# EAGLE design OYE328p (EAGLE 9.2.2)
The open Yag-E controller was designed to work with GRBL firmware https://github.com/gnea/grbl for use with the Open Yag-E project https://www.thingiverse.com/thing:3170231 This board is intended to use pololu a4988 or compatible drivers https://www.pololu.com/category/156/a4988-stepper-motor-driver-carriers Open Yag-E 328p Controller board by Jeff Thompson is licensed under a Creative Commons Attribution-ShareAlike 4.0 International License.
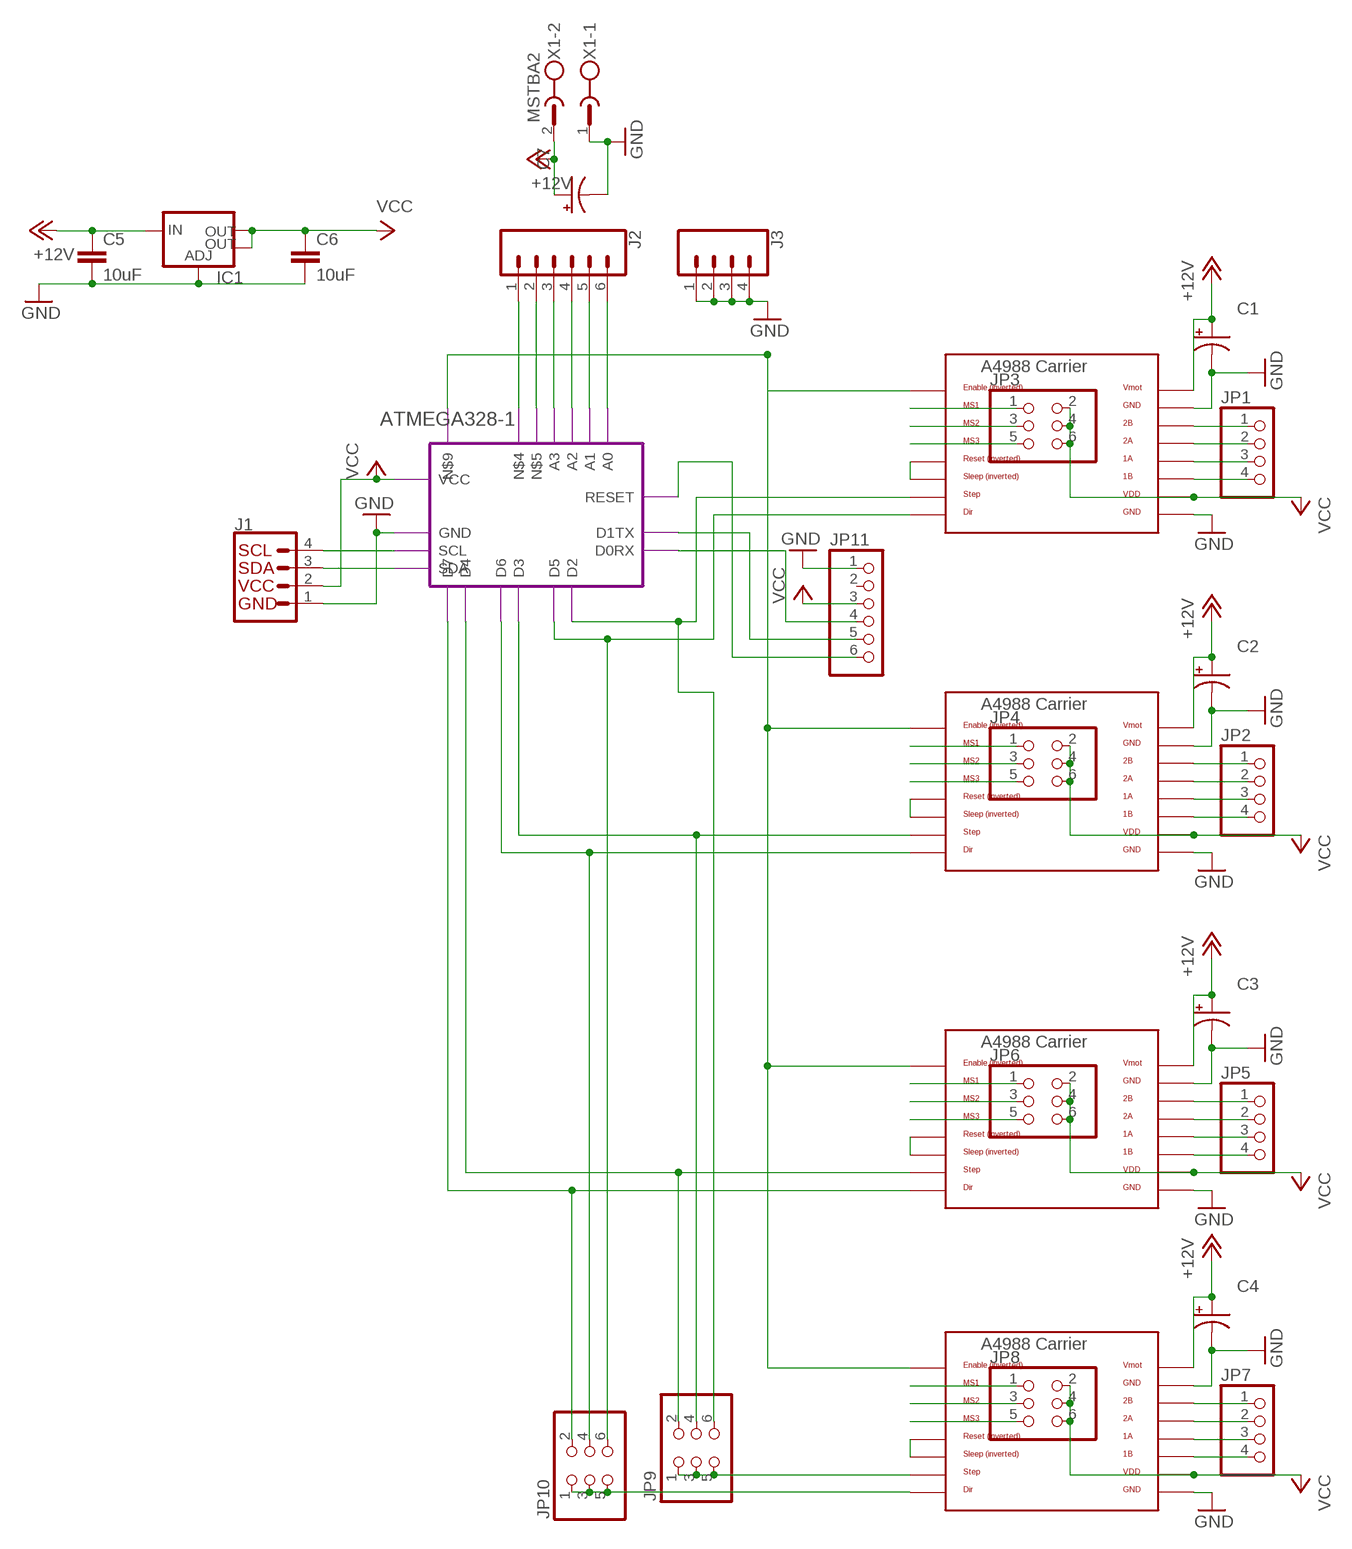
[diagram p0: schematic, sheet 1]

## Parts
C1  CPOL-USD  [PANASONIC_D]
C2  CPOL-USD  [PANASONIC_D]
C3  CPOL-USD  [PANASONIC_D]
C4  CPOL-USD  [PANASONIC_D]
C5  10uF  10UF-0805-10V-10%  [0805]
C6  10uF  10UF-0805-10V-10%  [0805]
C7  CPOL-USD  [PANASONIC_D]
IC1  V_REG_LM1117SOT223  [SOT223]
J1  I2C_STANDARD  [1X04]
J2  CONN_063.5MM-6  [SCREWTERMINAL-3.5MM-6]
J3  CONN_04SCREW  [SCREWTERMINAL-3.5MM-4]
JP1  PINHD-1X4  [1X04]
JP2  PINHD-1X4  [1X04]
JP3  PINHD-2X3  [2X03]
JP4  PINHD-2X3  [2X03]
JP5  PINHD-1X4  [1X04]
JP6  PINHD-2X3  [2X03]
JP7  PINHD-1X4  [1X04]
JP8  PINHD-2X3  [2X03]
JP9  PINHD-2X3  [2X03]
JP10  PINHD-2X3  [2X03]
JP11  PINHD-1X6  [1X06]
U$1  A4988BREAKOUT  [A4988BREAKOUT]
U$2  A4988BREAKOUT  [A4988BREAKOUT]
U$3  A4988BREAKOUT  [A4988BREAKOUT]
U$4  A4988BREAKOUT  [A4988BREAKOUT]
X1  MSTBA2  [MSTBA2]

## Module instances
ATMEGA328-1 = ATMEGA328

## Nets
+12V [power]: C1.+ C2.+ C3.+ C4.+ C5.1 C7.+ IC1.3(IN) U$1.VMOT U$2.VMOT U$3.VMOT U$4.VMOT X1.2
GND [12v]: C1.- C2.- C3.- C4.- C5.2 C6.2 C7.- IC1.1(ADJ) J1.1 J3.1 J3.2 J3.3 J3.4 JP11.1 U$1.GND U$1.GND@0(GND) U$2.GND U$2.GND@0(GND) U$3.GND U$3.GND@0(GND) U$4.GND U$4.GND@0(GND) X1.1 ; port ATMEGA328-1.GND
N$1 [sig]: JP4.1 U$2.MS1
N$2: JP4.3 U$2.MS2
N$3: JP4.5 U$2.MS3
N$4 [12v]: JP2.1 U$2.2B
N$5 [12v]: JP2.2 U$2.2A
N$6 [12v]: JP2.3 U$2.1A
N$7 [12v]: JP2.4 U$2.1B
N$8 [sig]: JP3.1 U$1.MS1
N$9: JP3.3 U$1.MS2
N$10: JP3.5 U$1.MS3
N$11: U$2.RST U$2.SLP(SLEEP)
N$12 [sig]: JP6.1 U$3.MS1
N$13 [12v]: JP1.1 U$1.2B
N$14 [12v]: JP1.2 U$1.2A
N$15 [12v]: JP1.3 U$1.1A
N$16 [12v]: JP1.4 U$1.1B
N$17: JP6.3 U$3.MS2
N$18: JP6.5 U$3.MS3
N$19 [12v]: JP5.1 U$3.2B
N$20 [12v]: JP5.2 U$3.2A
N$21 [12v]: JP5.3 U$3.1A
N$22 [12v]: JP5.4 U$3.1B
N$23: U$3.RST U$3.SLP(SLEEP)
N$24 [sig]: JP8.1 U$4.MS1
N$25: JP8.3 U$4.MS2
N$26: JP8.5 U$4.MS3
N$27 [12v]: JP7.1 U$4.2B
N$28 [12v]: JP7.2 U$4.2A
N$29 [12v]: JP7.3 U$4.1A
N$30 [12v]: JP7.4 U$4.1B
N$31: U$4.RST U$4.SLP(SLEEP)
N$32: U$1.EN U$2.EN U$3.EN U$4.EN ; port ATMEGA328-1.N$9
N$33: JP9.6 U$1.STEP ; port ATMEGA328-1.D2
N$34: JP10.6 U$1.DIR ; port ATMEGA328-1.D5
N$35: JP9.4 U$2.STEP ; port ATMEGA328-1.D3
N$36: JP10.4 U$2.DIR ; port ATMEGA328-1.D6
N$37: JP9.2 U$3.STEP ; port ATMEGA328-1.D4
N$38: JP10.2 U$3.DIR ; port ATMEGA328-1.D7
N$39: JP9.1 JP9.3 JP9.5 U$4.STEP
N$40: JP10.1 JP10.3 JP10.5 U$4.DIR
N$41: J2.1 ; port ATMEGA328-1.N$4
N$42: J2.2 ; port ATMEGA328-1.N$5
N$43: J2.3 ; port ATMEGA328-1.A3
N$44: J2.4 ; port ATMEGA328-1.A2
N$45: J2.5 ; port ATMEGA328-1.A1
N$46: J2.6 ; port ATMEGA328-1.A0
N$47: JP11.4 ; port ATMEGA328-1.D0RX
N$48: JP11.5 ; port ATMEGA328-1.D1TX
N$49: JP11.6 ; port ATMEGA328-1.RESET
N$50: J1.4 ; port ATMEGA328-1.SCL
N$51: J1.3 ; port ATMEGA328-1.SDA
N$54: U$1.RST U$1.SLP(SLEEP)
VCC [sig]: C6.1 IC1.2(OUT) IC1.4(OUT) J1.2 JP3.2 JP3.4 JP3.6 JP4.2 JP4.4 JP4.6 JP6.2 JP6.4 JP6.6 JP8.2 JP8.4 JP8.6 JP11.3 U$1.VDD U$2.VDD U$3.VDD U$4.VDD ; port ATMEGA328-1.VCC
Unconnected: JP11.2

## Library data of the parts
C1-C4 C7 = rcl:CPOL-US: POLARIZED CAPACITOR, American symbol; SPICEPREFIX: C
C5 C6 = SparkFun-Capacitors:10UF: 10.0µF ceramic capacitors A capacitor is a passive two-terminal electrical component used to store electrical energy temporarily in an electric field.; PROD_ID: CAP-11330
IC1 = SparkFun-IC-Power:V_REG_LM1117: Voltage Regulator LM1117 Standard adjustable voltage regulator but in SMD form. Spark Fun Electronics SKU : COM-00595; PROD_ID: VREG-08170
J1 = SparkFun-Connectors:I2C_STANDARD: SparkFun I2C Standard Pinout Header SparkFun has standardized on a pinout for all I2C based sensor breakouts. This pinout allows I2C boards to be plugged directly into the headers on Arduino Uno compatible boards, and to be daisy chained easily. Example SparkFun Products: SparkFun Atmospheric Sensor Breakout - BME280 <https://www.sparkfun.com/products/13676> SparkFun Altitude/Pressure Sensor Breakout - MPL3115A2 <https://www.sparkfun.com/products/11084> SparkFun TOF Range Finder Sensor - VL6180 <https://www.sparkfun.com/products/12785>
J2 = SparkFun-Connectors:CONN_06: Multi connection point. Often used as Generic Header-pin footprint for 0.1 inch spaced/style header connections On any of the 0.1 inch spaced packages, you can populate with these: Break Away Headers - Straight <https://www.sparkfun.com/products/116> (PRT-00116) Break Away Male Headers - Right Angle <https://www.sparkfun.com/products/553> (PRT-00553) Female Headers <https://www.sparkfun.com/products/115> (PRT-00115) Break Away Headers - Machine Pin <https://www.sparkfun.com/products/117> (PRT-00117) Break Away Female Headers - Swiss Machine Pin <https://www.sparkfun.com/products/743> (PRT-00743) Arduino Stackable Header - 6 Pin <https://www.sparkfun.com/products/9280> (PRT-09280) For SCREWTERMINALS and SPRING TERMINALS visit here: Screw Terimnals on SparkFun.com <https://www.sparkfun.com/search/results?term=Screw+Terminals> (5mm/3.5mm/2.54mm spacing) This device is also useful as a general connection point to wire up your design to another part of your project. Our various solder wires solder well into these plated through hole pads. Hook-Up Wire - Assortment (Stranded, 22 AWG) <https://www.sparkfun.com/products/11375> (PRT-11375) Hook-Up Wire - Assortment (Solid Core, 22 AWG) <https://www.sparkfun.com/products/11367> (PRT-11367) View the entire wire category on our website here <https://www.sparkfun.com/categories/141>
J3 = SparkFun-Connectors:CONN_04: Multi connection point. Often used as Generic Header-pin footprint for 0.1 inch spaced/style header connections On any of the 0.1 inch spaced packages, you can populate with these: Break Away Headers - Straight <https://www.sparkfun.com/products/116> (PRT-00116) Break Away Male Headers - Right Angle <https://www.sparkfun.com/products/553> (PRT-00553) Female Headers <https://www.sparkfun.com/products/115> (PRT-00115) Break Away Headers - Machine Pin <https://www.sparkfun.com/products/117> (PRT-00117) Break Away Female Headers - Swiss Machine Pin <https://www.sparkfun.com/products/743> (PRT-00743) For SCREWTERMINALS and SPRING TERMINALS visit here: Screw Terimnals on SparkFun.com <https://www.sparkfun.com/search/results?term=Screw+Terminals> (5mm/3.5mm/2.54mm spacing) This device is also useful as a general connection point to wire up your design to another part of your project. Our various solder wires solder well into these plated through hole pads. Hook-Up Wire - Assortment (Stranded, 22 AWG) <https://www.sparkfun.com/products/11375> (PRT-11375) Hook-Up Wire - Assortment (Solid Core, 22 AWG) <https://www.sparkfun.com/products/11367> (PRT-11367) View the entire wire category on our website here <https://www.sparkfun.com/categories/141> Special notes: Molex polarized connector foot print use with SKU : PRT-08231 with associated crimp pins and housings. 1MM SMD Version SKU: PRT-10208; PROD_ID: 2xCONN-08399; SF_ID: 2xPRT-08084
JP1 JP2 JP5 JP7 = RepRapjr:PINHD-1X4: PIN HEADER
JP3 JP4 JP6 JP8-JP10 = pinhead:PINHD-2X3: PIN HEADER
JP11 = pinhead:PINHD-1X6: PIN HEADER
U$1-U$4 = RepRapjr:A4988BREAKOUT
X1 = con-phoenix-508:MSTBA2: PHOENIX; MF: FARNELL; MPN: 1757242; OC_FARNELL: 3705171; OC_NEWARK: 71C4161

## Module ATMEGA328
Ports: N$9(io) VCC(io) GND(io) D7(io) D4(io) D6(io) D3(io) D5(io) D2(io) N$4(io) N$5(io) A3(io) A2(io) A1(io) A0(io) D0RX(io) D1TX(io) RESET(io) SCL(io) SDA(io)
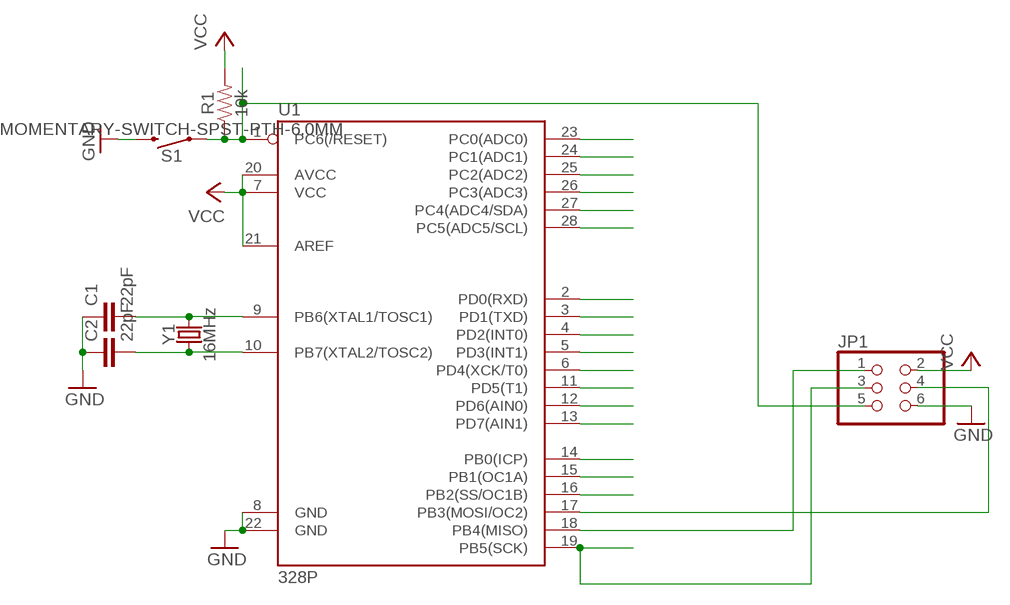
[diagram p1: schematic, module ATMEGA328, sheet 1]

### Parts
C1  22pF  22PF-PTH-2.54MM-200V-5%  [CAP-PTH-2.54]
C2  22pF  22PF-PTH-2.54MM-200V-5%  [CAP-PTH-2.54]
JP1  PINHD-2X3  [2X03]
R1  10k  10KOHM-VERT-1/4W-1%  [AXIAL-0.1]
S1  MOMENTARY-SWITCH-SPST-PTH-6.0MM  [TACTILE_SWITCH_PTH_6.0MM]
U1  328P  ATMEGA328P_PDIP  [DIP28]
Y1  16MHz  CRYSTAL-16MHZPTH-HC49US  [HC49US]

### Nets
A0: U1.23(PC0(ADC0))
A1: U1.24(PC1(ADC1))
A2: U1.25(PC2(ADC2))
A3: U1.26(PC3(ADC3))
D0RX: U1.2(PD0(RXD))
D1TX: U1.3(PD1(TXD))
D2: U1.4(PD2(INT0))
D3: U1.5(PD3(INT1))
D4: U1.6(PD4(XCK/T0))
D5: U1.11(PD5(T1))
D6: U1.12(PD6(AIN0))
D7: U1.13(PD7(AIN1))
GND: C1.1 C2.1 JP1.6 S1.3 U1.8(GND) U1.22(GND)
N$1: C1.2 U1.9(PB6(XTAL1/TOSC1)) Y1.2
N$2: C2.2 U1.10(PB7(XTAL2/TOSC2)) Y1.1
N$4: JP1.3 U1.19(PB5(SCK))
N$5: JP1.1 U1.18(PB4(MISO))
N$6: JP1.4 U1.17(PB3(MOSI/OC2))
N$7: U1.16(PB2(SS/OC1B))
N$8: U1.15(PB1(OC1A))
N$9: U1.14(PB0(ICP))
RESET: JP1.5 R1.P$1 S1.1 U1.1(PC6(/RESET))
SCL: U1.28(PC5(ADC5/SCL))
SDA: U1.27(PC4(ADC4/SDA))
VCC: JP1.2 R1.P$2 U1.7(VCC) U1.20(AVCC) U1.21(AREF)

### Library data of the parts
C1 C2 = SparkFun-Capacitors:22PF: 22pF ceramic capacitors A capacitor is a passive two-terminal electrical component used to store electrical energy temporarily in an electric field.; PROD_ID: CAP-09128
JP1 = pinhead:PINHD-2X3: PIN HEADER
R1 = SparkFun-Resistors:10KOHM: 10kΩ resistor A resistor is a passive two-terminal electrical component that implements electrical resistance as a circuit element. Resistors act to reduce current flow, and, at the same time, act to lower voltage levels within circuits. - Wikipedia; PROD_ID: RES-12183
S1 = SparkFun-Switches:MOMENTARY-SWITCH-SPST: Momentary Switch (Pushbutton) - SPST Normally-open (NO) SPST momentary switches (buttons, pushbuttons). Variants PTH-12MM - 12mm square, through-hole Momentary Pushbutton Switch - 12mm Square <https://www.sparkfun.com/products/9190> (COM-09190) PTH-6.0MM, PTH-6.0MM-KIT - 6.0mm square, through-hole Mini Pushbutton Switch <https://www.sparkfun.com/products/97> (COM-00097) KIT package intended for soldering kit's - only one side of pads' copper is exposed. PTH-RIGHT-ANGLE-KIT - Right-angle, through-hole Right Angle Tactile Button <https://www.sparkfun.com/products/10791> - Used on SparkFun BigTime Watch Kit <https://www.sparkfun.com/products/11734> SMD-12MM - 12mm square, surface-mount Tactile Button - SMD (12mm) <https://www.sparkfun.com/products/12993> (COM-12993) Used on SparkFun PicoBoard <https://www.sparkfun.com/products/11888> SMD-4.5MM - 4.5mm Square Trackball Switch Used on SparkFun Blackberry Trackballer Breakout <https://www.sparkfun.com/products/13169> SMD-4.6MMX2.8MM - 4.60mm x 2.80mm, surface mount Used on SparkFun SAMD21 Mini Breakout <https://www.sparkfun.com/products/13664> SMD-5.2MM, SMD-5.2-REDUNDANT - 5.2mm square, surface-mount Mini Pushbutton Switch - SMD <https://www.sparkfun.com/products/8720> (COM-08720) Used on Arduino Pro Mini <https://www.sparkfun.com/products/11114> REDUNDANT package connects both switch circuits together SMD-6.0X3.5MM - 6.0 x 3.5mm, surface mount Momentary Reset Switch SMD <https://www.sparkfun.com/products/8229> (COM-08229) SMD-6.2MM-TALL - 6.2mm square, surface mount Tactile Button - SMD (6mm) <https://www.sparkfun.com/products/12992> Used on SparkFun Digital Sandbox <https://www.sparkfun.com/products/12651> SMD-RIGHT-ANGLE - Right-angle, surface mount Used on SparkFun Block for Intel® Edison - Arduino <https://www.sparkfun.com/products/13036>; PROD_ID: SWCH-08441; SF_SKU: COM-00097
U1 = SparkFun-IC-Microcontroller:ATMEGA328P_PDIP: Atmel 328P Through hole ATMEGA328P uC used in the Arduino 32kb flash, 1k EEPROM, 2k SRAM Datasheet <http://www.sparkfun.com/datasheets/Components/SMD/ATMega328.pdf> SparkFun Products Storefront component: AVR 28 Pin 20MHz 32K 6A/D - ATMega328P <https://www.sparkfun.com/products/9061> (COM-09061) SparkFun Simon Says - Through-Hole Soldering Kit <https://www.sparkfun.com/products/10547> (KIT-10547) SparkFun Learn to Solder - Simon Says <https://www.sparkfun.com/products/13708> (KIT-13708) SparkFun BigTime Watch Kit <https://www.sparkfun.com/products/11734> (KIT-11734) SparkFun ClockIt <https://www.sparkfun.com/products/10930> (KIT-10930) SparkFun Serial Enabled LCD Kit <https://www.sparkfun.com/products/10097> (LCD-10097) SparkFun Simon Tilts - Through Hole Soldering Kit <https://www.sparkfun.com/products/12634> (KIT-12634) SparkFun Frequency Counter Kit <https://www.sparkfun.com/products/10140> (KIT-10140) FabFM Radio Kit <https://www.sparkfun.com/products/11043> (KIT-11043) SparkFun Binary Blaster Kit <https://www.sparkfun.com/products/12037> (KIT-12037) SparkFun Metro-Gnome <https://www.sparkfun.com/products/9236> (KIT-09236) ATmega328 with Arduino Optiboot (Uno) <https://www.sparkfun.com/products/10524> (DEV-10524); PROD_ID: IC-09136
Y1 = SparkFun-Clocks:CRYSTAL-16MHZ: 16MHz Crystal Digikey Example <http://www.digikey.com/product-search/en?keywords=535-9122-1-ND> Frequency: 16MHz Frequency Stability: ±50ppm Frequency Tolerance: ±20ppm Load Capacitance: 18pF SparkFun Products: Pro Micro -5V/16MHz <https://www.sparkfun.com/products/12640> SparkFun Serial Enabled LCD Kit <https://www.sparkfun.com/products/10097>; PROD_ID: XTAL-08181; SF_ID: COM-00536

## Net classes
0 default: clearance 0.205 mm
1 power: width 1.016 mm, drill 0.508 mm, clearance 0.205 mm to class 0, clearance 0.205 mm
2 12v: width 0.762 mm, drill 0.508 mm, clearance 0.205 mm to class 0, clearance 0.205 mm to class 1, clearance 0.205 mm
3 sig: width 0.254 mm, drill 0.254 mm, clearance 0.205 mm to class 0, clearance 0.205 mm to class 1, clearance 0.205 mm to class 2, clearance 0.205 mm

## Board
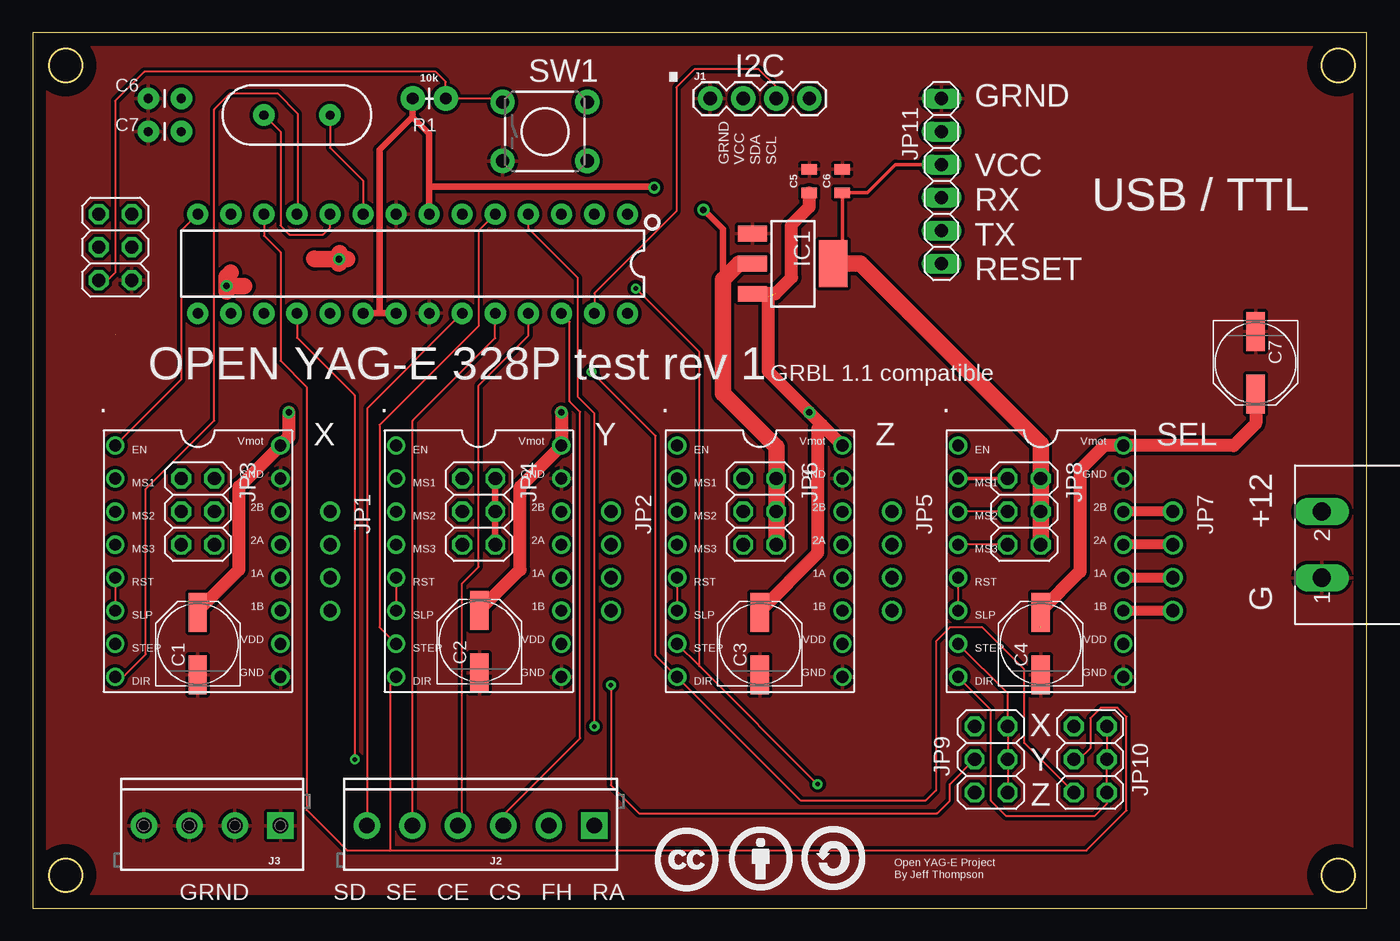
[diagram p2: board, top side]
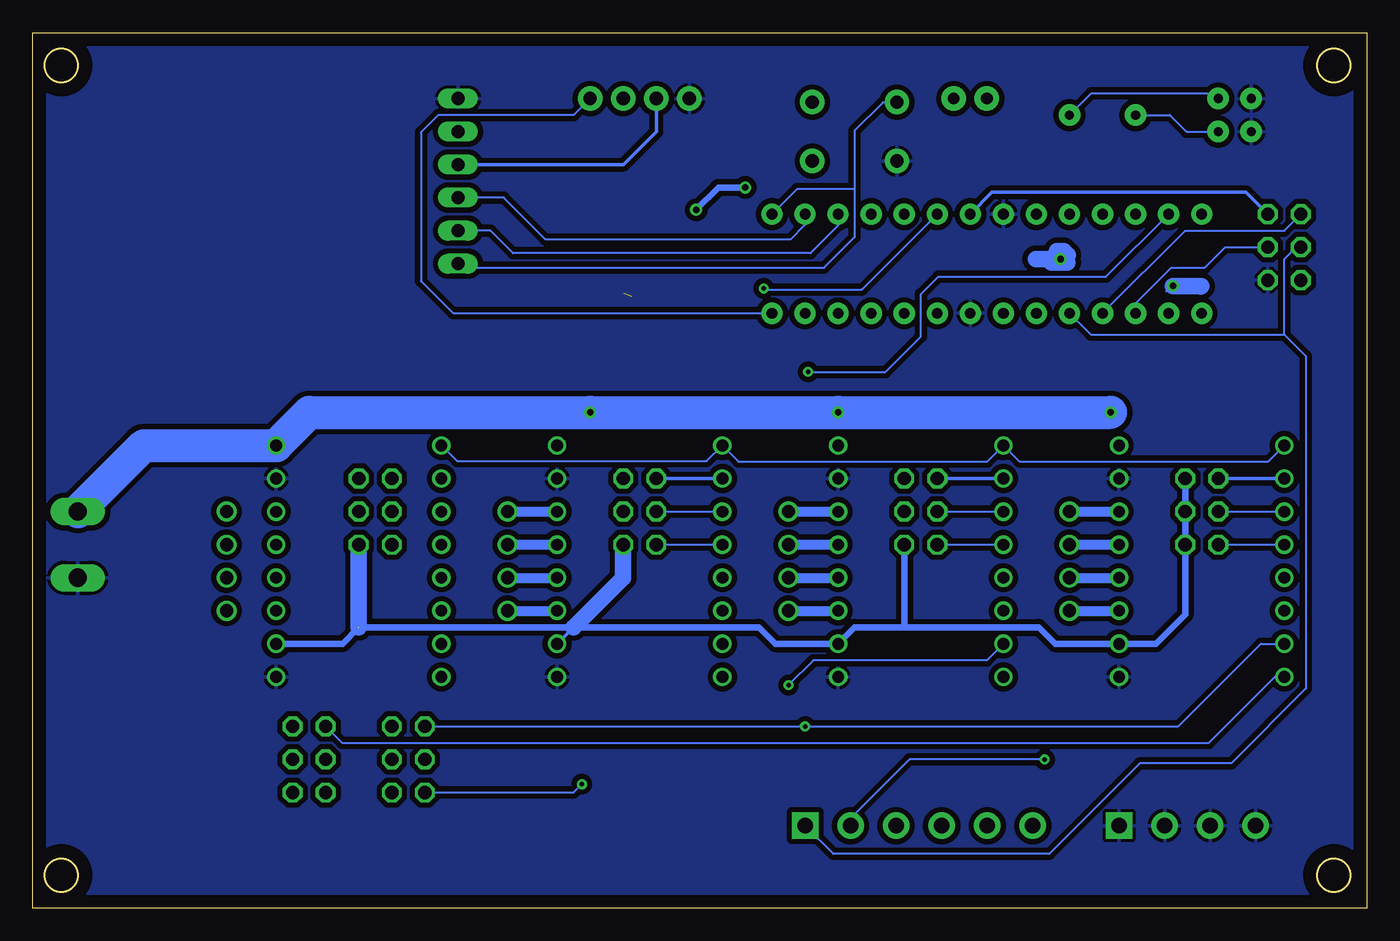
[diagram p3: board, bottom side, seen from below]

Size 102.54 x 67.3 mm. Coordinates in mm from the lower left corner, seen from the top.
Outline: 0,0 102.54,0 102.54,67.3 0,67.3 0,0
Outline: circle at 2.54,64.77 radius 1.27
Outline: circle at 2.54,2.54 radius 1.27
Outline: circle at 100.33,2.54 radius 1.27
Outline: circle at 100.33,64.77 radius 1.27
Copper layers (1*16): Top 0.035mm / dielectric 1.5mm / Bottom 0.035mm
Design rules "OYE328p": minimum track width 6mil, minimum drill 0.35mm, track to track 0.205mm, track to pad 0.205mm, pad to pad 0.205mm, via to via 0.205mm, smd to smd 6mil, copper to edge 40mil, drill to drill 6mil, minimum pad ring 10mil, minimum via ring 8mil, stop-mask expansion 4mil, vias tented up to drill 0mil, thermal gap 10mil

### Footprints (pad centres in the part's own frame; a part is rotated, then mirrored left to right if it is on the bottom)
CAP-PTH-2.54 = drill 0.7 pad 1.651: 1 -1.27,0; 2 1.27,0
2X03 = drill 1.016 octagon: 1 -2.54,-1.27; 2 -2.54,1.27; 3 0,-1.27; 4 0,1.27; 5 2.54,-1.27; 6 2.54,1.27
AXIAL-0.1 = drill 0.9 pad 1.88: P$1 -1.27,0; P$2 1.27,0
TACTILE_SWITCH_PTH_6.0MM = drill 1.016 pad 1.88: 1 -3.251,2.261; 2 3.251,2.261; 3 -3.251,-2.261; 4 3.251,-2.261
DIP28 = drill 0.813 pad 1.626: 1 -16.51,-3.81; 2 -13.97,-3.81; 3 -11.43,-3.81; 4 -8.89,-3.81; 5 -6.35,-3.81; 6 -3.81,-3.81; 7 -1.27,-3.81; 8 1.27,-3.81; 9 3.81,-3.81; 10 6.35,-3.81; 11 8.89,-3.81; 12 11.43,-3.81; 13 13.97,-3.81; 14 16.51,-3.81; 15 16.51,3.81; 16 13.97,3.81; 17 11.43,3.81; 18 8.89,3.81; 19 6.35,3.81; 20 3.81,3.81; 21 1.27,3.81; 22 -1.27,3.81; 23 -3.81,3.81; 24 -6.35,3.81; 25 -8.89,3.81; 26 -11.43,3.81; 27 -13.97,3.81; 28 -16.51,3.81
HC49US = drill 0.7 pad 1.651: 1 -2.54,0; 2 2.54,0
PANASONIC_D = smd 3 x 1.4: + 2.4,0; - -2.4,0
0805 = smd 0.8 x 1.2: 1 -0.9,0; 2 0.9,0
SOT223 = smd 1.219 x 2.235: 1 -2.311,-3.099; 2 0,-3.099; 3 2.311,-3.099 | smd 3.6 x 2.2: 4 0,3.099
1X04 = drill 1.016 pad 1.88: 1 0,0; 2 2.54,0; 3 5.08,0; 4 7.62,0
SCREWTERMINAL-3.5MM-6 = drill 1.2 pad 2.032 square: 1 0,0 | drill 1.2 pad 2.032: 2 3.5,0; 3 7,0; 4 10.5,0; 5 14,0; 6 17.5,0
SCREWTERMINAL-3.5MM-4 = drill 1.2 pad 2.032 square: 1 0,0 | drill 1.2 pad 2.032: 2 3.5,0; 3 7,0; 4 10.5,0
1X04' = drill 1.016: 1 -2.54,0; 2 0,0; 3 2.54,0; 4 5.08,0
1X06 = drill 1.016 long: 1 -6.35,0; 2 -3.81,0; 3 -1.27,0; 4 1.27,0; 5 3.81,0; 6 6.35,0
A4988BREAKOUT = drill 0.9: 1A 8.89,1.27; 1B 11.43,1.27; 2A 6.35,1.27; 2B 3.81,1.27; DIR 16.51,-11.43; EN -1.27,-11.43; GND 16.51,1.27; GND@0 1.27,1.27; MS1 1.27,-11.43; MS2 3.81,-11.43; MS3 6.35,-11.43; RST 8.89,-11.43; SLP 11.43,-11.43; STEP 13.97,-11.43; VDD 13.97,1.27; VMOT -1.27,1.27
MSTBA2 = drill 1.397 long: 1 -2.54,5.08; 2 2.54,5.08

### Placement (x,y rotation side)
ATMEGA328-1:C1  22pF  [CAP-PTH-2.54]  10.16,62.23 0 top
ATMEGA328-1:C2  22pF  [CAP-PTH-2.54]  10.16,59.69 0 top
ATMEGA328-1:JP1  [2X03]  6.35,50.8 270 top
ATMEGA328-1:R1  10k  [AXIAL-0.1]  30.48,62.23 180 top
ATMEGA328-1:S1  MOMENTARY-SWITCH-SPST-PTH-6.0MM  [TACTILE_SWITCH_PTH_6.0MM]  39.37,59.69 0 top
ATMEGA328-1:U1  328P  [DIP28]  29.21,49.53 180 top
ATMEGA328-1:Y1  16MHz  [HC49US]  20.32,60.96 0 top
C1  12.7,20.32 90 top
C2  34.34,20.5 90 top
C3  55.88,20.32 90 top
C4  77.47,20.32 90 top
C5  59.69,55.88 90 top
C6  62.23,55.88 90 top
C7  93.98,41.91 270 top
IC1  58.42,49.53 270 top
J1  52.07,62.23 0 top
J2  43.18,6.35 180 top
J3  19.05,6.35 180 top
JP1  [1X04']  22.86,27.94 270 top
JP2  [1X04']  44.45,27.94 270 top
JP3  12.7,30.48 270 top
JP4  34.29,30.48 270 top
JP5  [1X04']  66.04,27.94 270 top
JP6  55.88,30.48 270 top
JP7  [1X04']  87.63,27.94 270 top
JP8  76.2,30.48 270 top
JP9  73.66,11.43 90 top
JP10  81.28,11.43 90 top
JP11  69.85,55.88 270 top
U$1  17.78,34.29 270 top
U$2  39.37,34.29 270 top
U$3  60.96,34.29 270 top
U$4  82.55,34.29 270 top
X1  104.14,27.94 90 top

### Tracks (layer width: path | path; a pad name or v marks a point on that pad's centre or on a via)
+12V  (via drill 0.51)  (1 unrouted)
  Top 1.016: C5.1 59.69,53.91 58.33,52.55 58.33,48.48 57.07,47.22 IC1.3 | 60.64,37.15 v59.69,38.1 56.52,41.27 56.52,46.99 56.41,47.09 | 60.64,37.15 U$3.VMOT | C3.+ 55.88,22.86 60.32,27.3 60.32,36.83 60.64,37.15 | C2.+ 34.34,22.91 37.46,26.03 37.46,32.38 U$2.VMOT v40.64,38.1 | C1.+ 12.7,22.86 15.88,26.03 15.88,32.38 U$1.VMOT 19.68,36.2 v19.68,38.1 | C7.+ 93.98,37.24 92.3,35.56 U$4.VMOT 82.36,35.56 80.48,33.68 80.48,25.87 77.47,22.86 C4.+
  Bottom 2.54: v19.68,38.1 v40.64,38.1 v59.69,38.1 81.28,38.1 U$4.VMOT 93.98,35.56 X1.2
ATMEGA328-1:N$1
  Top 0.152: ATMEGA328-1:U1.9 25.4,55.9 22.86,58.45 ATMEGA328-1:Y1.2
  Bottom 0.152: ATMEGA328-1:C1.2 11.91,62.23 12.31,62.62 21.2,62.62 ATMEGA328-1:Y1.2
ATMEGA328-1:N$2
  Top 0.152: ATMEGA328-1:U1.10 22.86,52.31 22.33,51.78 19.74,51.78 19.05,52.46 19.05,59.69 ATMEGA328-1:Y1.1
  Bottom 0.152: ATMEGA328-1:C2.2 13.87,59.69 15.14,60.96 ATMEGA328-1:Y1.1
ATMEGA328-1:N$6
  Bottom 0.152: ATMEGA328-1:JP1.4 10.9,50.8 12.47,49.23 15.04,49.23 17.78,46.48 ATMEGA328-1:U1.17
GND
  pour Top (isolate 0.254): 0.09,67.2 0.09,0.18 102.41,0.18 102.41,67.2
  pour Bottom (isolate 0.406): 0.14,67.18 0.14,0.36 102.26,0.36 102.26,67.18
N$1
  Bottom 0.254: JP4.1 U$2.MS1
N$2
  Bottom 0.152: JP4.3 U$2.MS2
N$3
  Bottom 0.152: JP4.5 U$2.MS3
N$4
  Bottom 0.762: JP2.1 U$2.2B
N$5
  Bottom 0.762: JP2.2 U$2.2A
N$6
  Bottom 0.762: JP2.3 U$2.1A
N$7
  Bottom 0.762: JP2.4 U$2.1B
N$8
  Bottom 0.254: JP3.1 U$1.MS1
N$9
  Bottom 0.152: JP3.3 U$1.MS2
N$10
  Bottom 0.152: JP3.5 U$1.MS3
N$11
  Top 0.152: U$2.RST U$2.SLP
N$12
  Bottom 0.254: JP6.1 U$3.MS1
N$13
  Bottom 0.762: JP1.1 U$1.2B
N$14
  Bottom 0.762: JP1.2 U$1.2A
N$15
  Bottom 0.762: JP1.3 U$1.1A
N$16
  Bottom 0.762: JP1.4 U$1.1B
N$17
  Bottom 0.152: JP6.3 U$3.MS2
N$18
  Bottom 0.152: JP6.5 U$3.MS3
N$19
  Bottom 0.762: JP5.1 U$3.2B
N$20
  Bottom 0.762: JP5.2 U$3.2A
N$21
  Bottom 0.762: JP5.3 U$3.1A
N$22
  Bottom 0.762: JP5.4 U$3.1B
N$23
  Top 0.152: U$3.RST U$3.SLP
N$24
  Top 0.254: JP8.1 U$4.MS1
N$25
  Top 0.152: JP8.3 U$4.MS2
N$26
  Top 0.152: JP8.5 U$4.MS3
N$27
  Top 0.762: JP7.1 U$4.2B
N$28
  Top 0.762: JP7.2 U$4.2A
N$29
  Top 0.762: JP7.3 U$4.1A
N$30
  Top 0.762: JP7.4 U$4.1B
N$31
  Top 0.152: U$4.RST U$4.SLP
N$32
  Top 0.152: U$1.EN 11.43,40.64 11.43,52.07 ATMEGA328-1:U1.14
  Bottom 0.152: U$1.EN 7.58,34.33 26.71,34.33 U$2.EN 29.17,34.33 48.3,34.33 U$3.EN 50.74,34.35 69.91,34.35 U$4.EN
N$33  (via drill 0.35)
  Top 0.152: ATMEGA328-1:U1.4 38.1,52.23 41.91,48.42 41.91,39.29 43.18,38.02 v43.18,13.97
  Bottom 0.152: U$1.STEP 8.15,20.32 14.5,13.97 v43.18,13.97 JP9.6
N$34
  Top 0.152: ATMEGA328-1:U1.11 20.37,53.39 20.37,61.07 18.82,62.62 15.19,62.62 13.97,61.4 13.97,37.46 8.71,32.21 8.71,19.52 6.97,17.78 U$1.DIR
  Bottom 0.152: U$1.DIR 7.07,17.78 12.15,12.7 78.74,12.7 JP10.6
N$35  (via drill 0.35)
  Top 0.152: U$2.STEP 26.67,21.59 26.67,37.13 34.29,44.75 34.29,52.07 ATMEGA328-1:U1.5 | JP9.4 70.48,9.53 70.48,8.26 69.53,7.3 46.6,7.3 44.45,9.45 v44.45,17.14
  Bottom 0.152: v44.45,17.14 42.55,19.05 29.21,19.05 U$2.STEP
N$36
  Top 0.152: U$2.DIR 27.51,17.35 27.51,4.48 27.47,4.44 | 27.47,4.44 24.15,4.44 21.06,7.54 21.06,40.07 19.05,42.07 19.05,50.41 17.78,51.68 ATMEGA328-1:U1.12 | JP10.4 80.42,11.43 81.28,12.29 81.28,14.6 82.08,15.4 83.36,15.4 84.06,14.71 84.06,7.52 80.99,4.44 27.47,4.44
N$37  (via drill 0.35)
  Top 0.152: v60.32,9.53 51.24,18.61 | 51.24,18.61 U$3.STEP | v46.35,47.62 51.24,42.73 51.24,18.61
  Bottom 0.152: v60.32,9.53 60.96,8.89 JP9.2 | ATMEGA328-1:U1.6 38.81,47.55 46.28,47.55 v46.35,47.62
N$38  (via drill 0.35)
  Top 0.152: JP10.2 76.2,12.7 76.2,18.36 72.97,21.59 70.48,21.59 69.42,20.52 69.42,9.06 68.62,8.26 59.05,8.26 U$3.DIR 47.88,19.43 47.88,36.3 v42.95,41.22
  Bottom 0.152: ATMEGA328-1:U1.13 20.05,48.53 32.94,48.53 34.28,47.19 34.28,43.94 36.99,41.22 v42.95,41.22
N$39
  Top 0.152: JP9.1 JP9.3 JP9.5 74.93,16.51 U$4.STEP
N$40
  Top 0.152: JP10.5 JP10.3 JP10.1 82.55,8.03 81.6,7.07 74.84,7.07 73.66,8.26 73.66,15.24 U$4.DIR
N$41  (1 unrouted)
  Bottom 0.152: ATMEGA328-1:JP1.3 5.44,50.8 6.35,49.89 6.35,44.09 | ATMEGA328-1:U1.19 21.23,44.09 6.36,44.09 4.7,42.43 4.7,16.88 10.43,11.15 17.44,11.15 24.41,4.18 41.01,4.18 J2.1
N$42  (via drill 0.35)
  Top 0.152: v24.77,11.43 24.77,11.77 24.74,11.8 24.74,39.42 20.32,43.84 ATMEGA328-1:U1.18
  Bottom 0.152: ATMEGA328-1:JP1.1 6.35,52.07 13.97,52.07 ATMEGA328-1:U1.18 | J2.2 39.68,6.9 35.15,11.43 v24.77,11.43
N$43
  Top 0.152: ATMEGA328-1:U1.26 41.27,45.09 41.27,38.95 42.07,38.15 42.07,13.06 36.18,7.16 J2.3
N$44
  Top 0.152: ATMEGA328-1:U1.25 38.1,43.99 34.29,40.18 34.29,26.24 33.02,24.97 33.02,6.35 J2.4
N$45
  Top 0.152: ATMEGA328-1:U1.24 35.56,43.81 29.21,37.46 29.21,6.35 J2.5
N$46
  Top 0.152: ATMEGA328-1:U1.23 25.76,38.46 25.76,6.35 J2.6
N$47
  Bottom 0.152: JP11.4 66.34,54.61 63.13,51.4 44.31,51.4 43.18,52.53 ATMEGA328-1:U1.2
N$48
  Bottom 0.152: JP11.5 67.35,52.07 65.62,50.34 42.76,50.34 40.64,52.46 ATMEGA328-1:U1.3
N$49
  Top 0.152: ATMEGA328-1:JP1.5 5.78,48.26 6.35,48.83 6.35,62.05 8.59,64.29 30.97,64.29 31.75,63.51 ATMEGA328-1:R1.P$1 35.56,62.23 ATMEGA328-1:S1.1
  Bottom 0.152: JP11.6 69.55,49.23 41.72,49.23 39.37,51.57 39.37,55.24 | 39.37,55.24 39.37,59.77 37.21,61.93 36.12,61.93 ATMEGA328-1:S1.1 | ATMEGA328-1:U1.1 43.81,55.24 39.37,55.24
N$50
  Bottom 0.152: ATMEGA328-1:U1.28 70.22,45.72 72.68,48.18 72.68,59.64 71.36,60.96 60.96,60.96 J1.4
N$51
  Top 0.152: ATMEGA328-1:U1.27 43.18,47.27 49.47,53.56 49.47,63.08 50.88,64.49 55.79,64.49 57.15,63.13 J1.3
N$52  (via drill 0.51)
  Top 1.27: v14.91,47.83 16.24,47.83 16.27,47.8 | v14.91,47.83 14.91,48.53 15.23,48.84 | v14.91,47.83 14.91,47.41 14.92,47.4
  Bottom 0.152: v14.91,47.83 14.91,47.41 15.43,47.41
  Bottom 1.27: v14.91,47.83 12.74,47.83 12.71,47.8 12.75,47.8 12.78,47.78
N$53  (via drill 0.51)
  Top 1.27: v23.55,49.89 21.69,49.89 21.65,49.92 | v23.55,49.89 23.55,50.29 23.6,50.34 23.6,49.59 23.53,49.53 | v23.55,49.89 24.14,49.89 24.15,49.9
  Bottom 1.27: v23.55,49.89 25.44,49.89 25.45,49.9 | v23.55,49.89 23.29,49.63 | 23.29,49.63 23.01,49.63 | 23.29,49.63 24.23,49.63 24.29,49.7 | v23.55,49.89 23.32,49.89 23,50.2 23.3,50.51 23.82,50.51
N$54
  Top 0.152: U$1.RST U$1.SLP
VCC  (via drill 0.51)  (1 unrouted)
  Top 0.254: 29.21,60.81 29.2,60.81 | JP11.3 66.32,57.15 64.15,54.98 C6.1 62.23,49.53 IC1.4 | 54.27,49.53 IC1.2
  Top 0.508: ATMEGA328-1:U1.21 26.67,45.72 | 26.67,45.72 ATMEGA328-1:U1.20 | ATMEGA328-1:R1.P$2 29.21,60.81 30.48,59.54 30.48,55.45 | ATMEGA328-1:U1.7 30.48,55.45 | 26.67,45.72 26.67,58.28 29.2,60.81 | JP4.2 JP4.4 JP4.6 | 30.48,55.45 47.71,55.45 v47.78,55.38 | v51.55,53.68 53.05,52.18 53.05,48.31
  Top 1.27: JP8.6 JP8.4 JP8.2 77.47,35.66 63.6,49.53 IC1.4 | 54.27,49.53 53.05,48.31 53.05,39.55 57.15,35.45 JP6.2 JP6.4 JP6.6
  Bottom 0.254: ATMEGA328-1:JP1.2 9.3,55.02 28.8,55.02 ATMEGA328-1:U1.7 | 35.56,21.67 35.64,21.59 | J1.2 54.61,59.66 57.12,57.15 JP11.3 | 60.96,21.59 U$3.VDD
  Bottom 0.508: JP4.6 35.56,21.67 | U$4.VDD 78.73,20.32 77.45,21.6 | 77.47,21.59 60.96,21.59 46.74,21.59 45.47,20.32 U$2.VDD 39.37,21.59 35.64,21.59 25.22,21.59 23.95,20.32 U$1.VDD 16.22,20.32 13.97,22.57 JP3.6 JP3.4 JP3.2 | v47.78,55.38 49.85,55.38 v51.55,53.68
  Bottom 1.27: JP8.6 77.47,21.59 | 60.96,21.59 57.15,25.4 JP6.6

### Text on the board
tPlace: I2C | SW1 | . | C6 / / C7 | R1 | GRND / VCC / SDA / SCL | USB / TTL | GRND / / VCC / RX / TX / RESET | OPEN YAG-E 328P test rev 1 | GRBL 1.1 compatible | . | . | . | . | X | Y | Z | SEL | +12 | G | X / Y / Z | Open YAG-E Project / By Jeff Thompson | GRND | SD SE CE CS FH RA